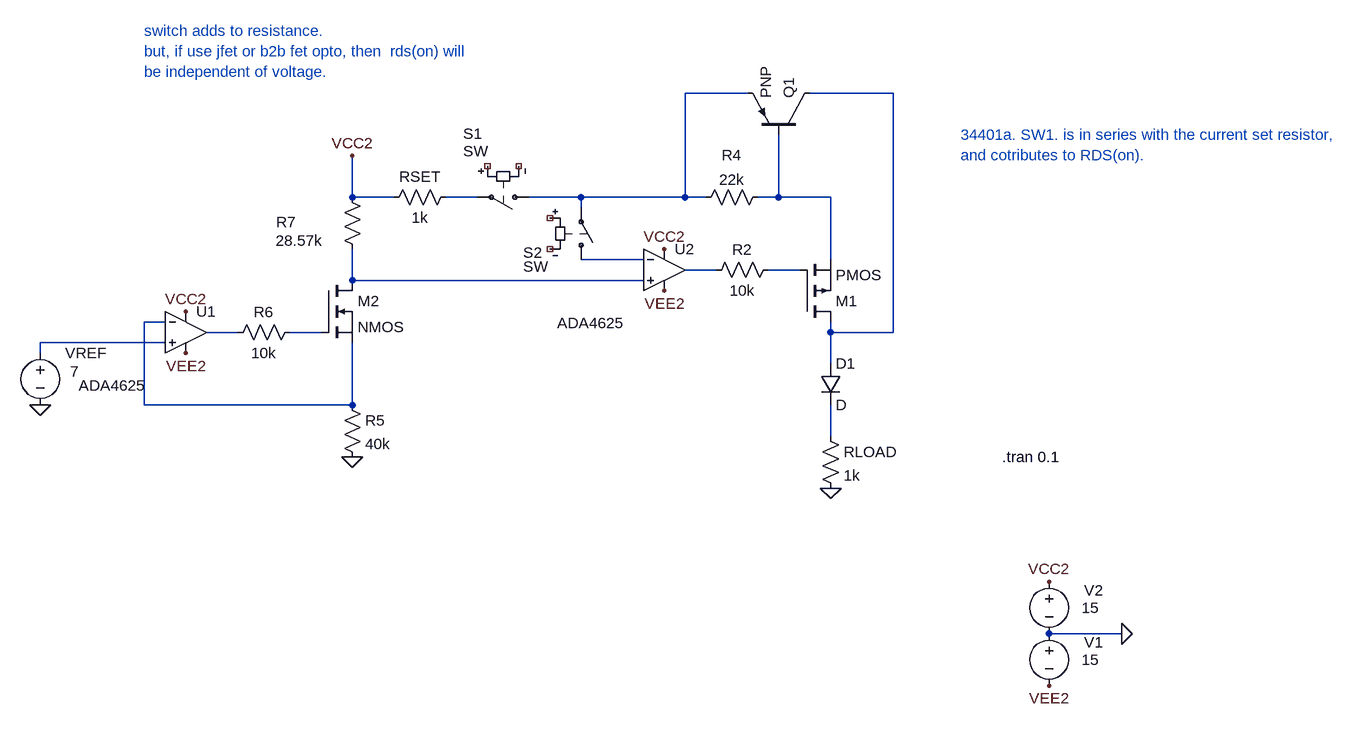
[diagram p0: schematic Draft17.asc]
Draft17.asc, the LTspice schematic file:
Version 4
SHEET 1 1768 872
WIRE 544 -144 448 -144
WIRE 768 -144 640 -144
WIRE -64 16 -64 -48
WIRE 0 16 -64 16
WIRE 128 16 80 16
WIRE 288 16 208 16
WIRE 448 16 448 -144
WIRE 448 16 288 16
WIRE 480 16 448 16
WIRE 592 16 592 -80
WIRE 592 16 560 16
WIRE 672 16 592 16
WIRE 288 32 288 16
WIRE 384 112 288 112
WIRE 672 112 672 16
WIRE 496 128 448 128
WIRE 624 128 576 128
WIRE -64 144 -64 96
WIRE 384 144 -64 144
WIRE -64 160 -64 144
WIRE -352 208 -384 208
WIRE -240 224 -288 224
WIRE -112 224 -160 224
WIRE 672 224 672 208
WIRE 768 224 768 -144
WIRE 768 224 672 224
WIRE -352 240 -544 240
WIRE -544 256 -544 240
WIRE 672 272 672 224
WIRE -384 336 -384 208
WIRE -64 336 -64 240
WIRE -64 336 -384 336
WIRE 672 384 672 336
WIRE 1120 688 1008 688
FLAG 1120 688 0
FLAG 1008 768 VEE2
FLAG 1008 608 VCC2
FLAG 416 160 VEE2
FLAG 416 96 VCC2
FLAG -320 256 VEE2
FLAG -320 192 VCC2
FLAG -544 336 0
FLAG -64 416 0
FLAG -64 -48 VCC2
FLAG 672 464 0
SYMBOL voltage 1008 672 R0
WINDOW 0 54 29 Left 2
WINDOW 3 50 56 Left 2
WINDOW 123 0 0 Left 0
WINDOW 39 0 0 Left 0
SYMATTR InstName V1
SYMATTR Value 15
SYMBOL res 656 368 R0
SYMATTR InstName RLOAD
SYMATTR Value 1k
SYMBOL res 96 0 R90
WINDOW 0 0 56 VBottom 2
WINDOW 3 32 56 VTop 2
SYMATTR InstName RSET
SYMATTR Value 1k
SYMBOL pmos 624 208 M180
SYMATTR InstName M1
SYMBOL voltage 1008 592 R0
WINDOW 0 54 29 Left 2
WINDOW 3 50 56 Left 2
WINDOW 123 0 0 Left 0
WINDOW 39 0 0 Left 0
SYMATTR InstName V2
SYMATTR Value 15
SYMBOL res 592 112 R90
WINDOW 0 0 56 VBottom 2
WINDOW 3 32 56 VTop 2
SYMATTR InstName R2
SYMATTR Value 10k
SYMBOL res 576 0 R90
WINDOW 0 -33 56 VBottom 2
WINDOW 3 -27 56 VTop 2
SYMATTR InstName R4
SYMATTR Value 22k
SYMBOL pnp 640 -80 M270
SYMATTR InstName Q1
SYMBOL OpAmps\\ADA4625 416 64 R0
WINDOW 3 -165 146 Left 2
SYMATTR InstName U2
SYMBOL diode 656 272 R0
SYMATTR InstName D1
SYMBOL res -80 320 R0
SYMATTR InstName R5
SYMATTR Value 40k
SYMBOL res -144 208 R90
WINDOW 0 0 56 VBottom 2
WINDOW 3 32 56 VTop 2
SYMATTR InstName R6
SYMATTR Value 10k
SYMBOL OpAmps\\ADA4625 -320 160 R0
WINDOW 3 -165 146 Left 2
SYMATTR InstName U1
SYMBOL voltage -544 240 R0
WINDOW 123 0 0 Left 0
WINDOW 39 0 0 Left 0
WINDOW 3 46 44 Left 2
WINDOW 0 38 16 Left 2
SYMATTR Value 7
SYMATTR InstName VREF
SYMBOL res -80 0 R0
WINDOW 0 -101 54 Left 2
WINDOW 3 -102 83 Left 2
SYMATTR InstName R7
SYMATTR Value 28.57k
SYMBOL nmos -112 144 R0
SYMATTR InstName M2
SYMBOL sw 224 16 R90
WINDOW 0 -98 88 VRight 2
WINDOW 3 -71 79 VRight 2
SYMATTR InstName S1
SYMBOL sw 288 128 M180
WINDOW 0 -89 27 Left 2
WINDOW 3 -89 5 Left 2
SYMATTR InstName S2
TEXT 936 416 Left 2 !.tran 0.1
TEXT -384 -240 Left 2 ;switch adds to resistance. \nbut, if use jfet or b2b fet opto, then  rds(on) will \nbe independent of voltage.
TEXT 872 -80 Left 2 ;34401a. SW1. is in series with the current set resistor,\nand cotributes to RDS(on).

The netlist it stands for:
* Draft17.asc
V1 0 VEE2 15
RLOAD N013 0 1k
RSET N003 VCC2 1k
M1 N002 N007 N004 N004 PMOS
V2 VCC2 0 15
R2 N007 N006 10k
R4 N004 N001 22k
Q1 N002 N004 N001 0 PNP
XU2 N008 N005 VCC2 VEE2 N006 ADA4625  ; pins In+ In- V+ V- OUT
D1 N002 N013 D
R5 N009 0 40k
R6 N011 N010 10k
XU1 N012 N009 VCC2 VEE2 N010 ADA4625  ; pins In+ In- V+ V- OUT
VREF N012 0 7
R7 VCC2 N008 28.57k
M2 N008 N011 N009 N009 NMOS
S1 N001 N003 NC_01 NC_02 SW
S2 N005 N001 NC_03 NC_04 SW
.model D D
.lib standard.dio
.model NPN NPN
.model PNP PNP
.lib standard.bjt
.model NMOS NMOS
.model PMOS PMOS
.lib standard.mos
.tran 0.1
* switch adds to resistance.
* but, if use jfet or b2b fet opto, then  rds(on) will
* be independent of voltage.
* 34401a. SW1. is in series with the current set resistor,
* and cotributes to RDS(on).
.backanno
.end